# EAGLE design untitled (EAGLE 9.5.2)
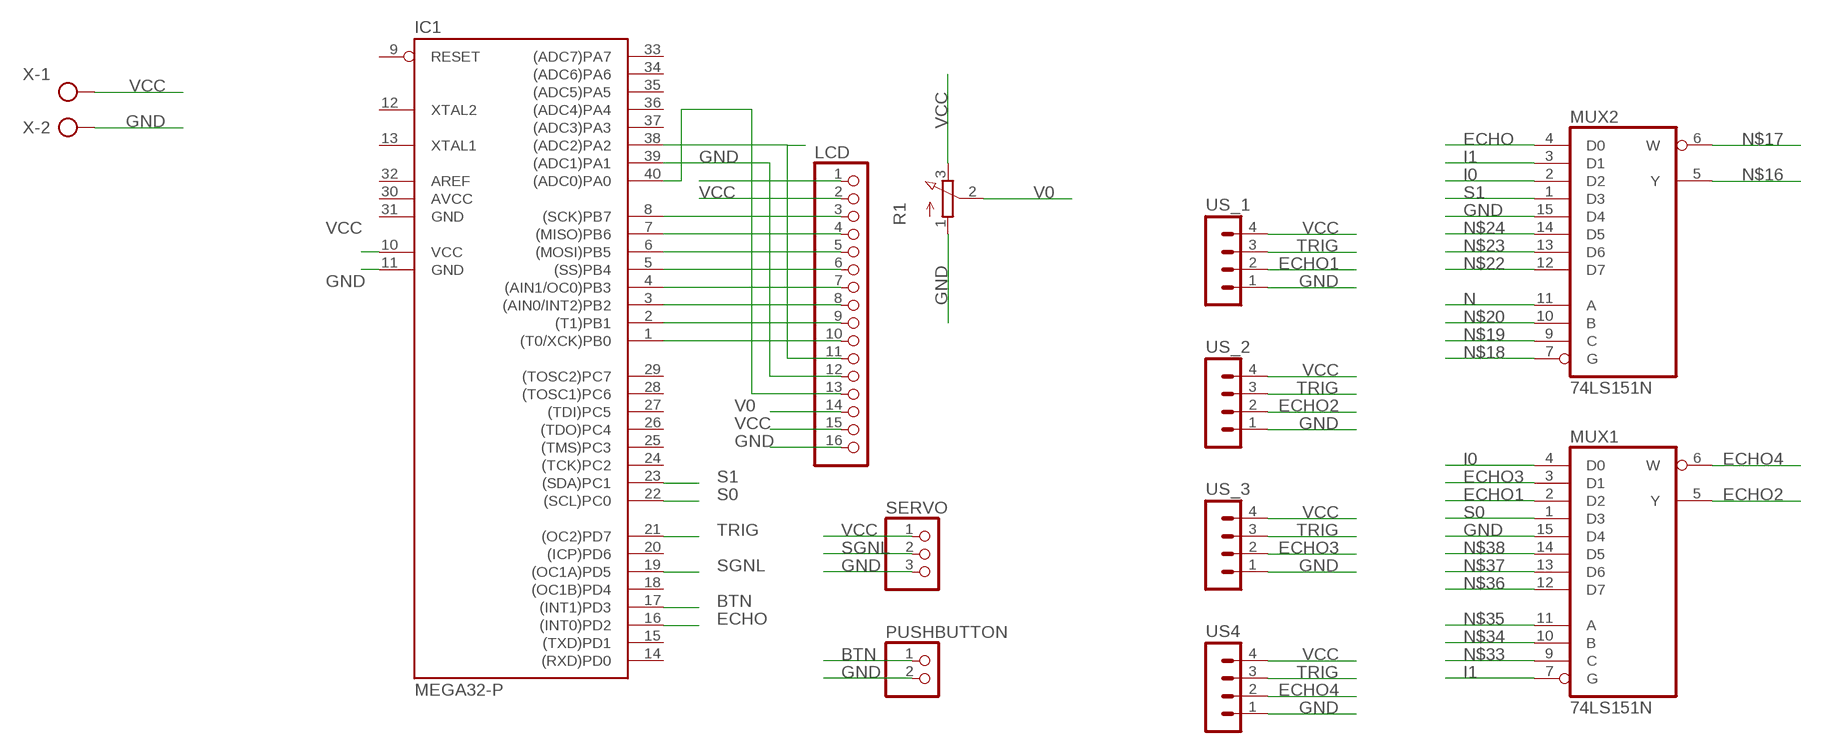
[diagram p0: schematic, sheet 1]

## Parts
IC1  MEGA32-P  [DIL40]
LCD  PINHD-1X16  [1X16]
MUX1  74LS151N  [DIL16]
MUX2  74LS151N  [DIL16]
PUSHBUTTON  PINHD-1X2  [1X02]
R1  3RP/1610N  [3RP/1610N]
SERVO  PINHD-1X3  [1X03]
US4  MA04-1  [MA04-1]
US_1  MA04-1  [MA04-1]
US_2  MA04-1  [MA04-1]
US_3  MA04-1  [MA04-1]
X  AK300/2  [AK300/2]

## Nets
BTN: IC1.17((INT1)PD3) PUSHBUTTON.1
ECHO: IC1.16((INT0)PD2) MUX2.4(D0)
ECHO1: MUX1.2(D2) US_1.2
ECHO2: MUX1.5(Y) US_2.2
ECHO3: MUX1.3(D1) US_3.2
ECHO4: MUX1.6(W) US4.2
GND: IC1.11(GND) LCD.1 LCD.16 MUX1.15(D4) MUX2.15(D4) PUSHBUTTON.2 R1.1(A) SERVO.3 US4.1 US_1.1 US_2.1 US_3.1 X.2
I0: MUX1.4(D0) MUX2.2(D2)
I1: MUX1.7(G) MUX2.3(D1)
N: MUX2.11(A)
N$1: IC1.38((ADC2)PA2) LCD.11
N$2: IC1.39((ADC1)PA1) LCD.12
N$3: IC1.8((SCK)PB7) LCD.3
N$4: IC1.7((MISO)PB6) LCD.4
N$5: IC1.6((MOSI)PB5) LCD.5
N$6: IC1.5((SS)PB4) LCD.6
N$7: IC1.4((AIN1/OC0)PB3) LCD.7
N$8: IC1.3((AIN0/INT2)PB2) LCD.8
N$9: IC1.2((T1)PB1) LCD.9
N$10: IC1.1((T0/XCK)PB0) LCD.10
N$11: IC1.40((ADC0)PA0) LCD.13
N$16: MUX2.5(Y)
N$17: MUX2.6(W)
N$18: MUX2.7(G)
N$19: MUX2.9(C)
N$20: MUX2.10(B)
N$22: MUX2.12(D7)
N$23: MUX2.13(D6)
N$24: MUX2.14(D5)
N$33: MUX1.9(C)
N$34: MUX1.10(B)
N$35: MUX1.11(A)
N$36: MUX1.12(D7)
N$37: MUX1.13(D6)
N$38: MUX1.14(D5)
S0: IC1.22((SCL)PC0) MUX1.1(D3)
S1: IC1.23((SDA)PC1) MUX2.1(D3)
SGNL: IC1.19((OC1A)PD5) SERVO.2
TRIG: IC1.21((OC2)PD7) US4.3 US_1.3 US_2.3 US_3.3
V0: LCD.14 R1.2(S)
VCC: IC1.10(VCC) LCD.2 LCD.15 R1.3(E) SERVO.1 US4.4 US_1.4 US_2.4 US_3.4 X.1
Unconnected: IC1.9(RESET) IC1.12(XTAL2) IC1.13(XTAL1) IC1.14((RXD)PD0) IC1.15((TXD)PD1) IC1.18((OC1B)PD4) IC1.20((ICP)PD6) IC1.24((TCK)PC2) IC1.25((TMS)PC3) IC1.26((TDO)PC4) IC1.27((TDI)PC5) IC1.28((TOSC1)PC6) IC1.29((TOSC2)PC7) IC1.32(AREF) IC1.33((ADC7)PA7) IC1.34((ADC6)PA6) IC1.35((ADC5)PA5) IC1.36((ADC4)PA4) IC1.37((ADC3)PA3)

## Power pins joined to a net without a drawn wire
AVCC: IC1.30(AVCC)
GND: IC1.31(GND) MUX1.8(GND) MUX2.8(GND)
VCC: MUX1.16(VCC) MUX2.16(VCC)

## Library data of the parts
IC1 = atmel:MEGA32-P: MICROCONTROLLER 32 Kbytes FLASH 2 Kbytes SRAM 1 Kbytes EEPROM USART 8-channel 10 bit ADC Source: www.atmel.com .. doc2503.pdf; MPN: ATMEGA32-16PU; OC_FARNELL: 1661729; OC_NEWARK: 51P1794
LCD = pinhead:PINHD-1X16: PIN HEADER
MUX1 MUX2 = 74xx-us:74*151: Data SELECTOR/MULTIPLEXER
PUSHBUTTON = pinhead:PINHD-1X2: PIN HEADER
R1 = pot:3RP/1610N: 16mm Potentiometer one level Source: http://www.alphapotentiometers.net/html/16mm_pot_2.html
SERVO = pinhead:PINHD-1X3: PIN HEADER
US4 US_1-US_3 = con-lstb:MA04-1: PIN HEADER; OC_FARNELL: unknown; OC_NEWARK: unknown
X = con-ptr500:AK300/2: CONNECTOR; OC_FARNELL: unknown; OC_NEWARK: unknown

## Board
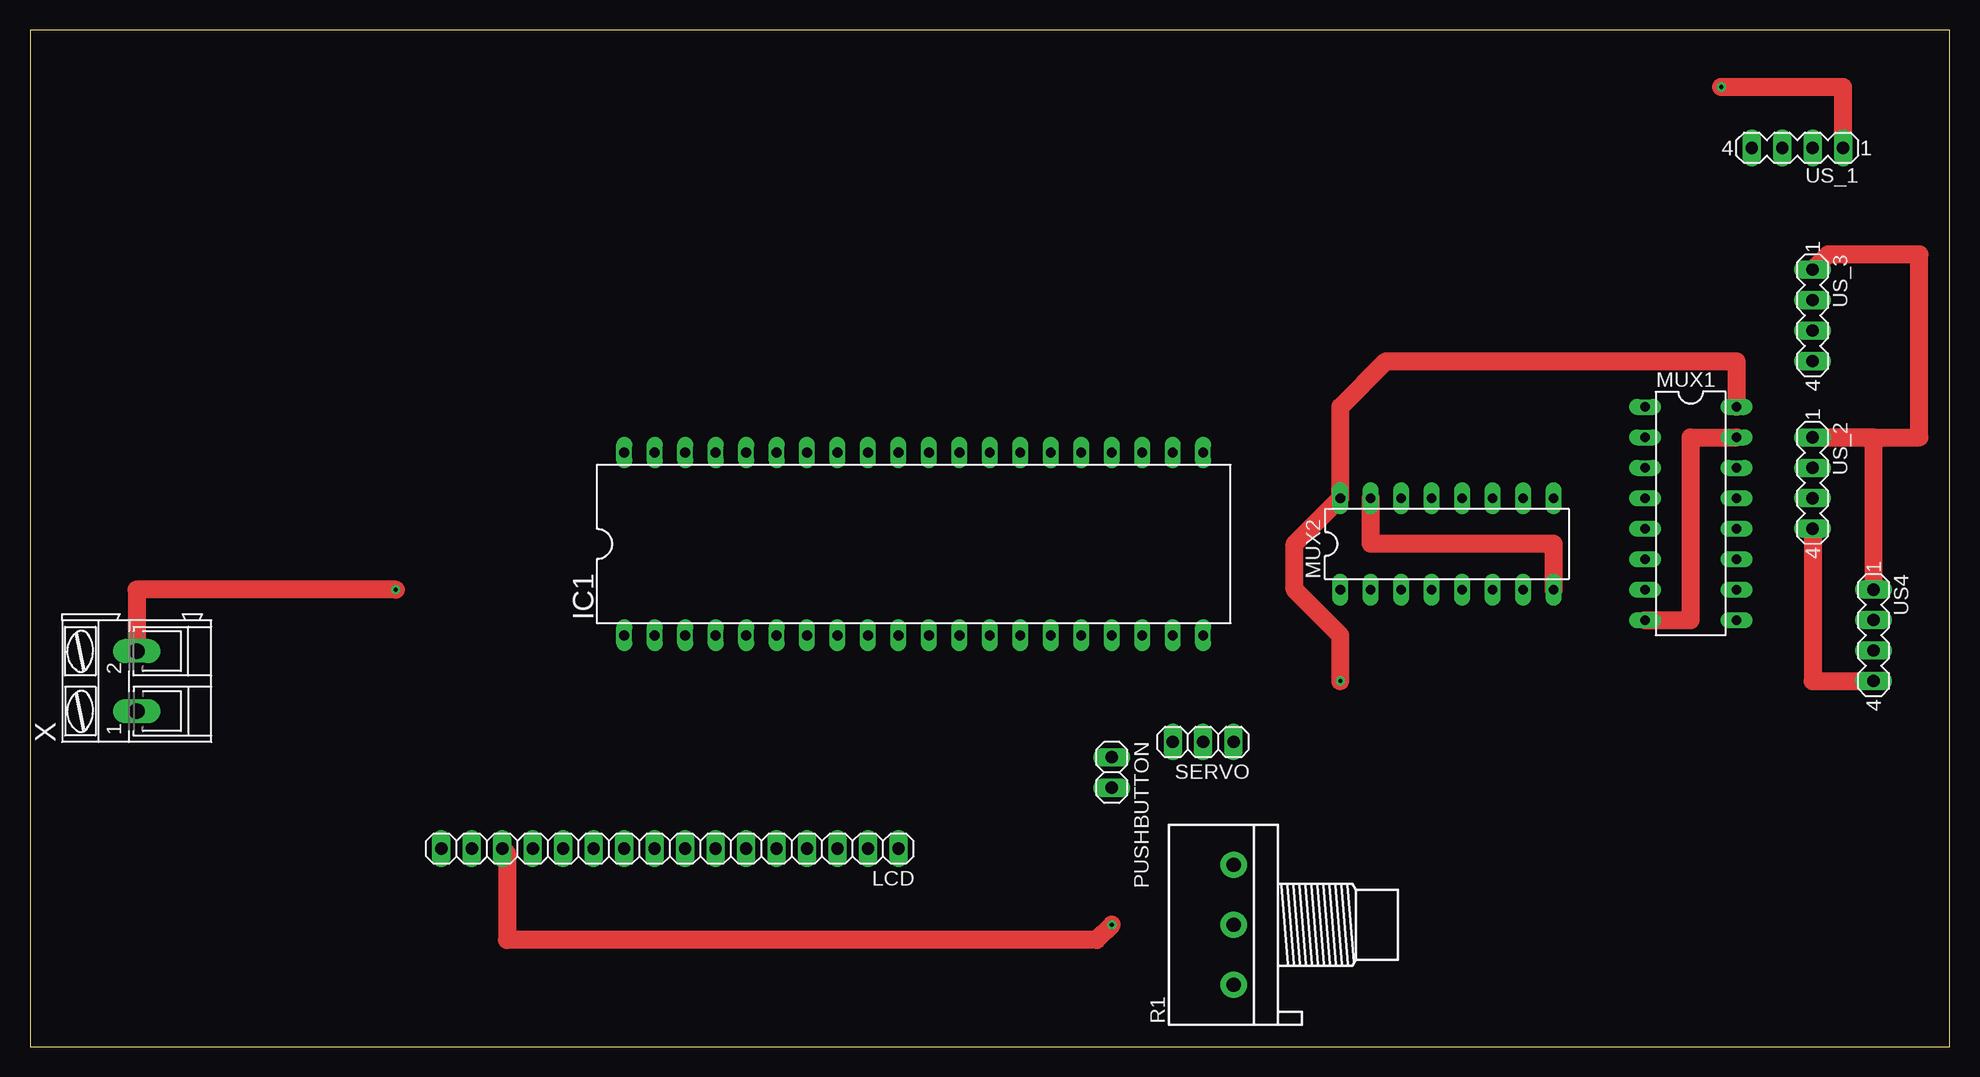
[diagram p1: board, top side]
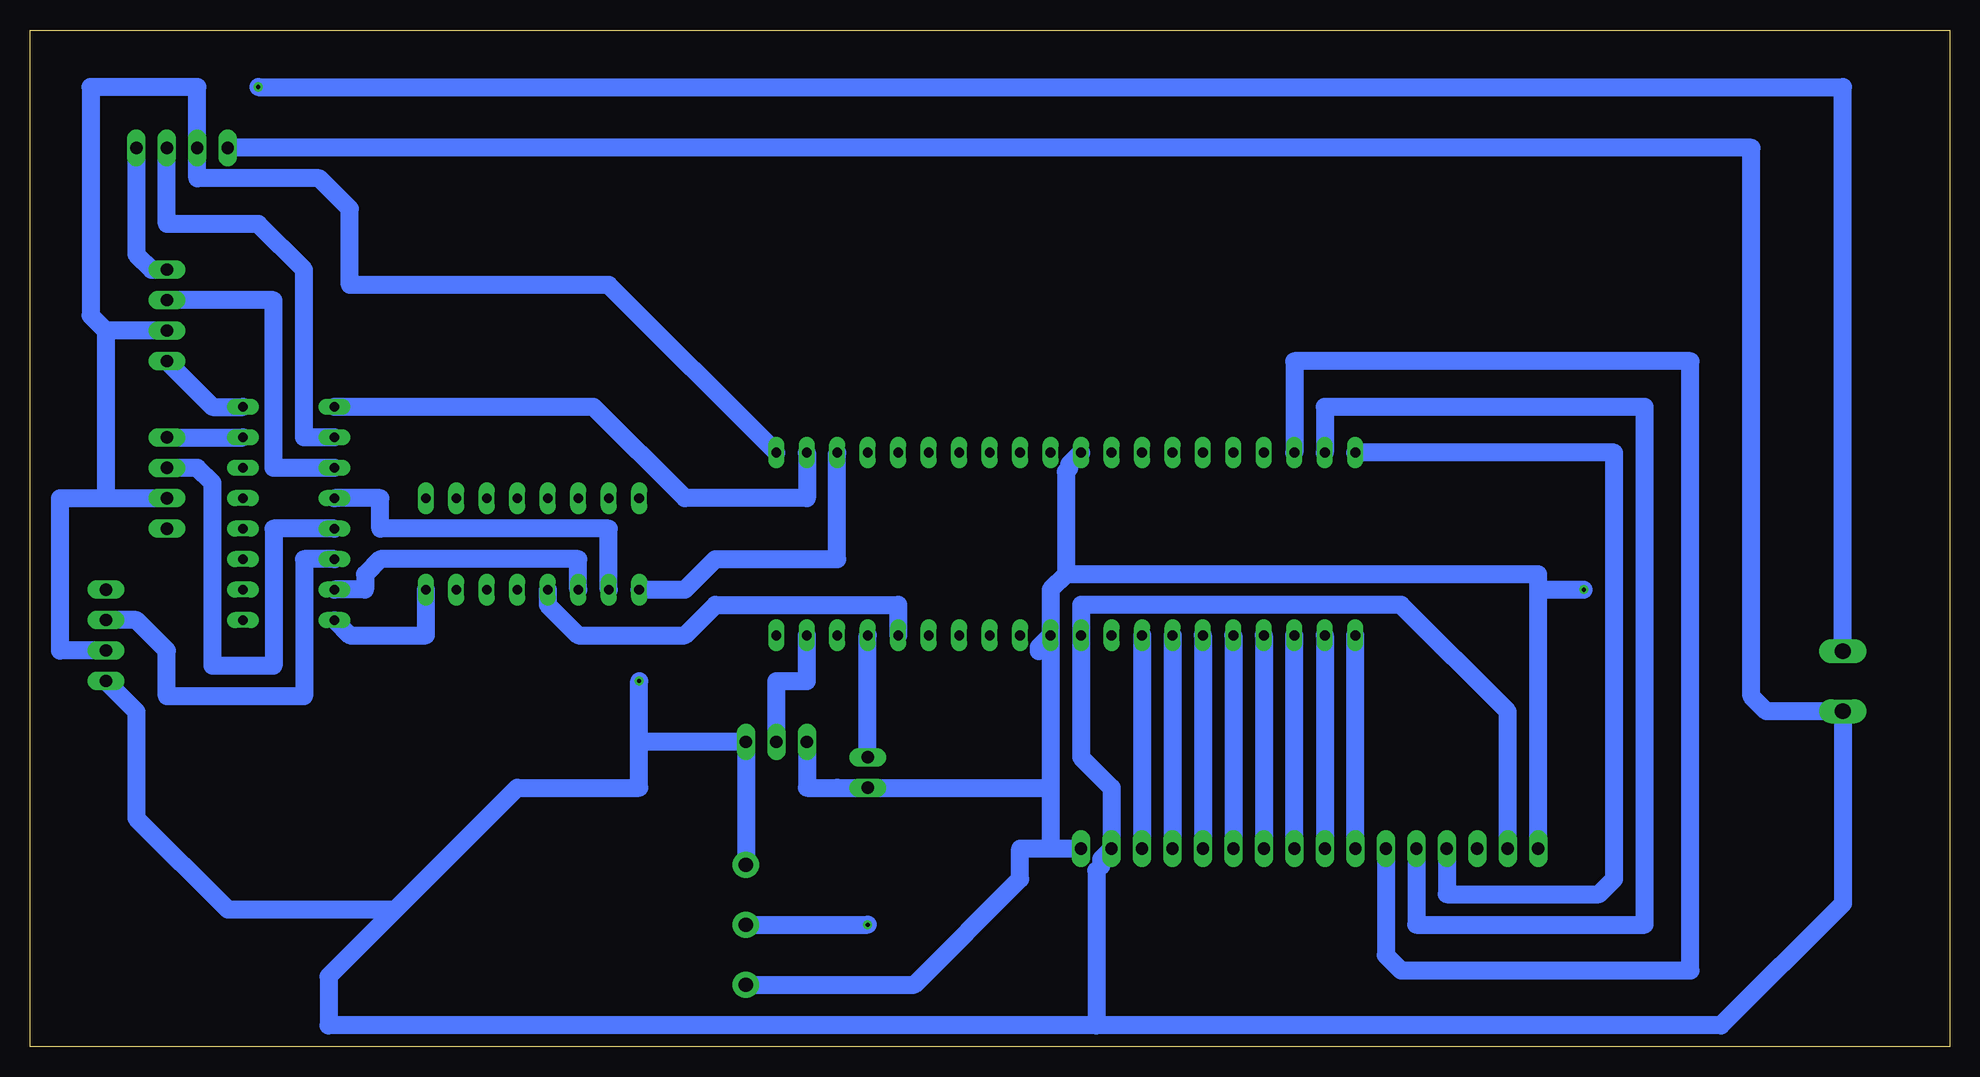
[diagram p2: board, bottom side, seen from below]

Size 160 x 84.76 mm. Coordinates in mm from the lower left corner, seen from the top.
Outline: 0,0 160,0 160,84.76 0,84.76 0,0
Copper layers (1*16): Top 0.035mm / dielectric 1.5mm / Bottom 0.035mm
Design rules "default *": minimum track width 0.5mil, minimum drill 0.35mm, track to track 6mil, track to pad 6mil, pad to pad 6mil, via to via 6mil, smd to smd 6mil, copper to edge 40mil, drill to drill 6mil, minimum pad ring 10mil, minimum via ring 8mil, stop-mask expansion 4mil, vias tented up to drill 0mil, thermal gap 10mil

### Footprints (pad centres in the part's own frame; a part is rotated, then mirrored left to right if it is on the bottom)
DIL40 = drill 0.813 long: 1 -24.13,-7.62; 2 -21.59,-7.62; 3 -19.05,-7.62; 4 -16.51,-7.62; 5 -13.97,-7.62; 6 -11.43,-7.62; 7 -8.89,-7.62; 8 -6.35,-7.62; 9 -3.81,-7.62; 10 -1.27,-7.62; 11 1.27,-7.62; 12 3.81,-7.62; 13 6.35,-7.62; 14 8.89,-7.62; 15 11.43,-7.62; 16 13.97,-7.62; 17 16.51,-7.62; 18 19.05,-7.62; 19 21.59,-7.62; 20 24.13,-7.62; 21 24.13,7.62; 22 21.59,7.62; 23 19.05,7.62; 24 16.51,7.62; 25 13.97,7.62; 26 11.43,7.62; 27 8.89,7.62; 28 6.35,7.62; 29 3.81,7.62; 30 1.27,7.62; 31 -1.27,7.62; 32 -3.81,7.62; 33 -6.35,7.62; 34 -8.89,7.62; 35 -11.43,7.62; 36 -13.97,7.62; 37 -16.51,7.62; 38 -19.05,7.62; 39 -21.59,7.62; 40 -24.13,7.62
1X16 = drill 1.016 long: 1 -19.05,0; 2 -16.51,0; 3 -13.97,0; 4 -11.43,0; 5 -8.89,0; 6 -6.35,0; 7 -3.81,0; 8 -1.27,0; 9 1.27,0; 10 3.81,0; 11 6.35,0; 12 8.89,0; 13 11.43,0; 14 13.97,0; 15 16.51,0; 16 19.05,0
DIL16 = drill 0.813 long: 1 -8.89,-3.81; 2 -6.35,-3.81; 3 -3.81,-3.81; 4 -1.27,-3.81; 5 1.27,-3.81; 6 3.81,-3.81; 7 6.35,-3.81; 8 8.89,-3.81; 9 8.89,3.81; 10 6.35,3.81; 11 3.81,3.81; 12 1.27,3.81; 13 -1.27,3.81; 14 -3.81,3.81; 15 -6.35,3.81; 16 -8.89,3.81
1X02 = drill 1.016 long: 1 -1.27,0; 2 1.27,0
3RP/1610N = drill 1.2 pad 2.184: 1 -5,0; 2 0,0; 3 5,0
1X03 = drill 1.016 long: 1 -2.54,0; 2 0,0; 3 2.54,0
MA04-1 = drill 1.016 long: 1 -3.81,0; 2 -1.27,0; 3 1.27,0; 4 3.81,0
AK300/2 = drill 1.321 long: 1 -2.515,0; 2 2.489,0

### Placement (x,y rotation side)
IC1  73.66,41.91 0 top
LCD  53.34,16.51 180 top
MUX1  138.43,44.45 270 top
MUX2  118.11,41.91 0 top
PUSHBUTTON  90.17,22.86 270 top
R1  100.33,10.16 90 top
SERVO  97.79,25.4 180 top
US4  153.67,34.29 270 top
US_1  147.32,74.93 180 top
US_2  148.59,46.99 270 top
US_3  148.59,60.96 270 top
X  8.89,30.48 90 top

### Tracks (layer width: path | path; a pad name or v marks a point on that pad's centre or on a via)
BTN
  Bottom 1.5: PUSHBUTTON.1 IC1.17
ECHO
  Bottom 1.5: MUX2.4 116.84,36.83 114.3,34.29 105.41,34.29 102.87,36.83 87.63,36.83 IC1.16
ECHO1
  Bottom 1.5: MUX1.2 137.16,50.8 137.16,64.77 140.97,68.58 148.59,68.58 US_1.2
ECHO2
  Bottom 1.5: MUX1.5 139.7,43.18 139.7,31.75 144.78,31.75 144.78,46.99 146.05,48.26 US_2.2
ECHO3
  Bottom 1.5: US_3.2 139.7,62.23 139.7,48.26 MUX1.3
ECHO4
  Bottom 1.5: MUX1.6 137.16,40.64 137.16,29.21 148.59,29.21 148.59,33.02 151.13,35.56 US4.2
GND  (via drill 0.35)
  Top 1.5: MUX2.8 127,41.91 111.76,41.91 MUX2.15 | MUX1.8 138.43,35.56 138.43,50.8 MUX1.15 | US4.1 153.67,50.8 US_2.1 157.48,50.8 157.48,66.04 149.86,66.04 US_3.1 | v30.48,38.1 8.89,38.1 X.2 | US_1.1 151.13,80.01 v140.97,80.01
  Bottom 1.5: IC1.11 75.91,33.31 75.91,32.98 | X.2 8.89,80.01 v140.97,80.01 | 73.66,39.37 34.29,39.37 34.29,38.1 | 73.66,39.37 74.93,38.1 IC1.11 | 100.41,5.08 R1.1 86.28,5.16 77.47,13.97 77.47,16.51 74.93,16.51 | US_1.1 151.13,66.04 149.86,64.77 US_3.1 | IC1.31 73.37,48.55 73.37,48.22 73.66,47.93 73.66,39.37 | MUX1.8 133.35,34.29 127,34.29 MUX2.8 | US_2.1 MUX1.15 | 34.29,38.1 v30.48,38.1 | LCD.1 74.93,16.51 | LCD.16 34.29,38.1 | IC1.11 74.93,21.59 | 74.93,21.59 74.93,16.51 | 74.93,21.59 PUSHBUTTON.2 92.71,21.59 94.67,21.59 95.25,21.59 SERVO.3
I0
  Bottom 1.5: MUX2.2 111.76,43.18 130.81,43.18 130.81,45.72 MUX1.4
I1
  Bottom 1.5: MUX2.3 114.3,40.64 130.81,40.64 132.08,39.37 132.08,38.1 MUX1.7
N$1
  Bottom 1.5: LCD.11 46.99,7.62 45.72,6.35 21.59,6.35 21.59,57.15 54.61,57.15 IC1.38
N$2
  Bottom 1.5: LCD.12 44.45,10.16 25.4,10.16 25.4,53.34 52.07,53.34 IC1.39
N$3
  Bottom 1.5: IC1.8 LCD.3
N$4
  Bottom 1.5: IC1.7 LCD.4
N$5
  Bottom 1.5: IC1.6 LCD.5
N$6
  Bottom 1.5: IC1.5 LCD.6
N$7
  Bottom 1.5: IC1.4 LCD.7
N$8
  Bottom 1.5: LCD.8 IC1.3
N$9
  Bottom 1.5: IC1.2 LCD.9
N$10
  Bottom 1.5: LCD.10 IC1.1
N$11
  Bottom 1.5: LCD.13 41.91,12.7 29.21,12.7 27.94,13.97 27.94,49.53 IC1.40
S0
  Bottom 1.5: IC1.22 95.25,45.72 105.41,45.72 113.03,53.34 MUX1.1
S1
  Bottom 1.5: MUX2.1 105.41,38.1 102.87,40.64 92.71,40.64 IC1.23
SGNL
  Bottom 1.5: SERVO.2 97.79,30.48 95.25,30.48 IC1.19
TRIG
  Bottom 1.5: US_3.3 153.67,59.69 | 153.67,59.69 153.67,45.72 | 153.67,45.72 US_2.3 | US4.3 157.48,33.02 157.48,45.72 153.67,45.72 | 153.67,59.69 154.94,60.96 154.94,80.01 146.05,80.01 US_1.3 146.05,72.39 135.89,72.39 133.35,69.85 133.35,63.5 111.76,63.5 IC1.21
V0  (via drill 0.35)
  Top 1.5: v90.17,10.16 88.9,8.89 39.76,8.89 39.76,16.12 LCD.14
  Bottom 1.5: R1.2 v90.17,10.16
VCC  (via drill 0.35)
  Top 1.5: v109.22,30.48 109.22,34.29 105.41,38.1 105.41,41.91 MUX2.16 109.22,53.34 113.03,57.15 142.24,57.15 MUX1.16 | US_2.4 148.59,30.48 US4.4
  Bottom 1.5: 71.12,1.77 19.05,1.77 8.89,11.93 X.1 15.27,27.96 16.51,29.21 16.51,74.93 US_1.4 | 71.12,1.77 135.12,1.77 135.12,5.85 129.54,11.43 | US4.4 151.13,27.94 151.13,19.05 143.51,11.43 129.54,11.43 | 129.54,11.43 119.38,21.59 109.22,21.59 109.22,25.4 | US_3.4 144.78,53.34 MUX1.16 | 109.22,25.4 v109.22,30.48 | 71.12,1.77 71.12,14.66 70.73,15.06 70.73,15.63 LCD.2 69.85,21.59 72.39,24.13 IC1.10 72.39,36.83 45.72,36.83 36.83,27.94 LCD.15 | 109.22,25.4 SERVO.1 R1.3